# Altium schematic sheet Sheet_1_2022-04-25.schdoc
size 309 x 219 mm
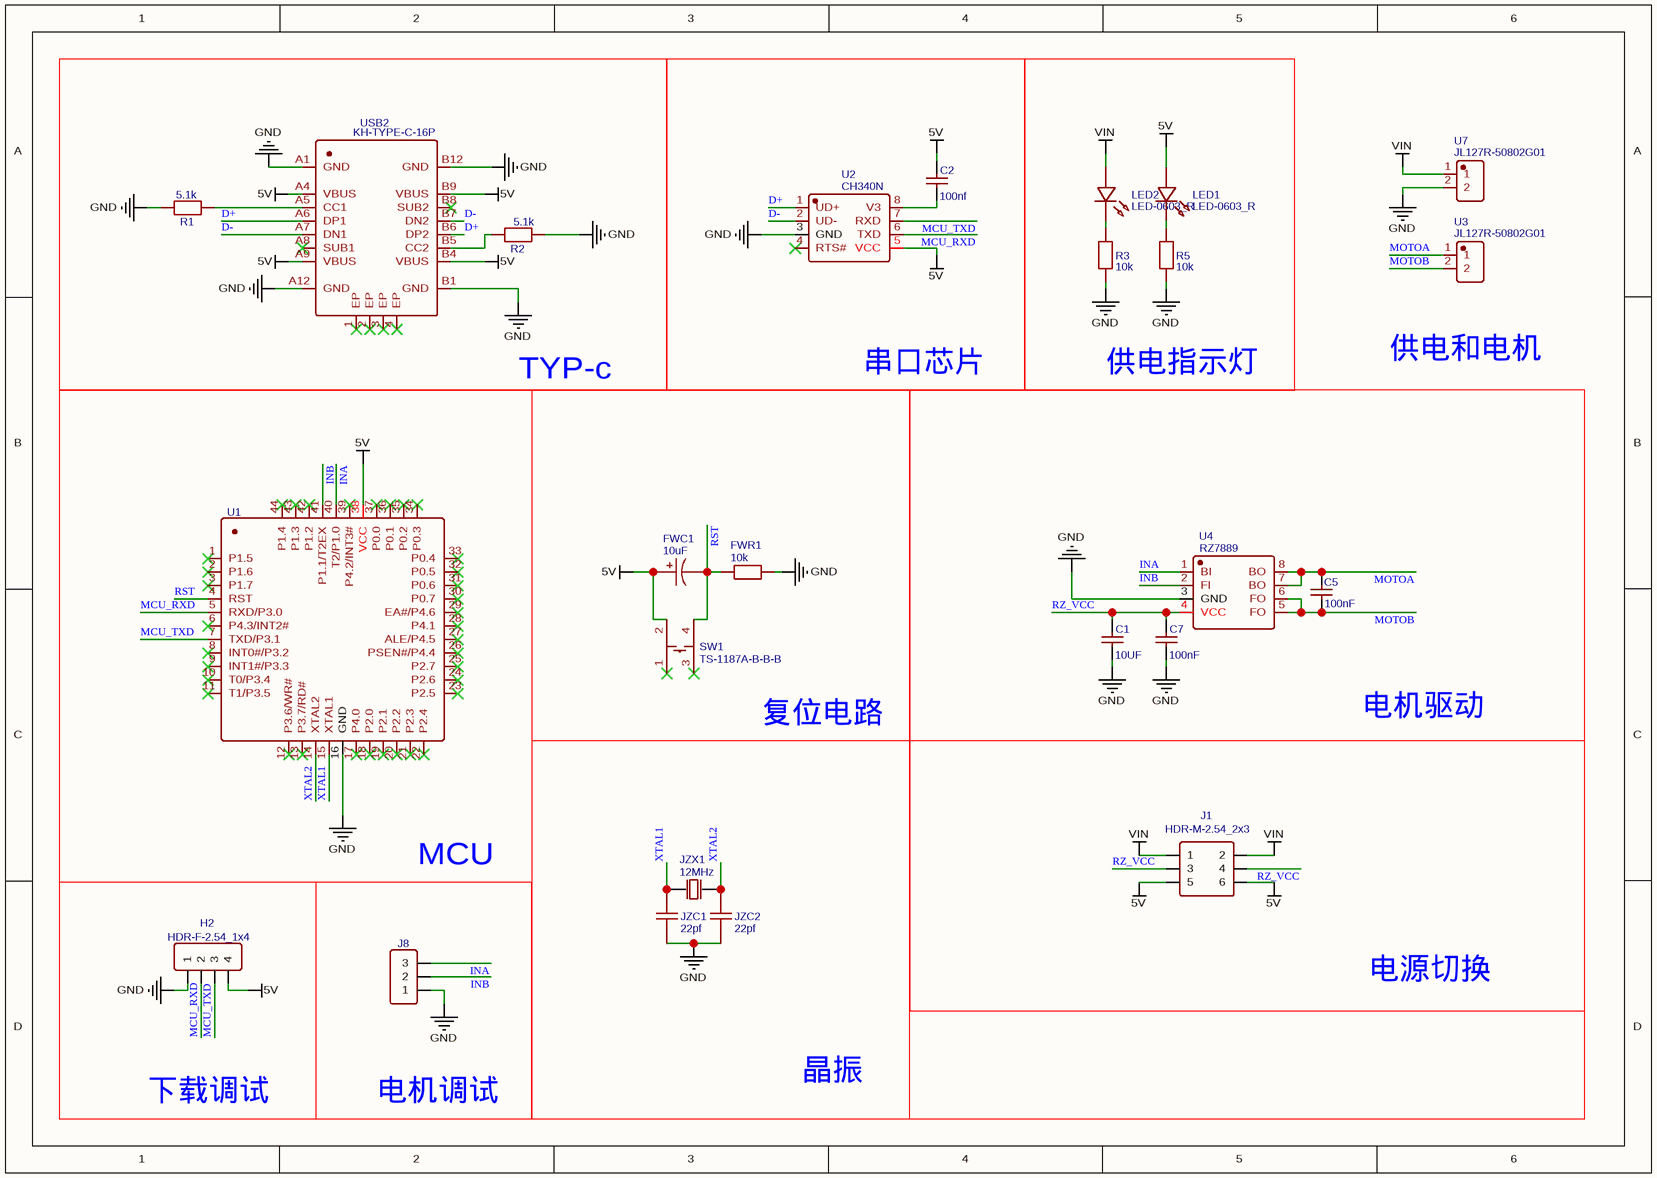
[diagram p0: Sheet_1_2022-04-25.schdoc]

## Parts
C1  10UF  [C0603]
C2  100nf  [C0603]
C5  100nF  [C0603]
C7  100nF  [C0603]
FWC1  10uF  [CASE-A_3216]
FWR1  10k  [R0603]
H2  HDR-F-2.54_1x4  [HDR-F-2.54_1X4]
J1  HDR-M-2.54_2x3  [HDR-M-2.54_2X3]
J8  HDR-M-2.54_1x3  [HDR-M-2.54_1X3]  (value not drawn)
JZC1  22pf  [C0603]
JZC2  22pf  [C0603]
JZX1  12MHz  [HC-49US_L11.5-W4.5-P4.88]
LED1  LED-0603_R  [LED0603_RED]
LED2  LED-0603_R  [LED0603_RED]
R1  5.1k  [R0603]
R2  5.1k  [R0603]
R3  10k  [R0603]
R5  10k  [R0603]
SW1  TS-1187A-B-B-B  [SW-SMD_4P-L5.1-W5.1-P3.70-LS6.5-TL-2]
U1  C8707-40I_C8707  [LQFP-44_L10.0-W10.0-P0.80-LS12.0-BL]  (value not drawn)
U2  CH340N  [SOP-8_L5.0-W4.0-P1.27-LS6.0-BL]
U3  JL127R-50802G01  [CONN-TH_3P-P5.08_JL127R-50802G01]
U4  RZ7889  [SOP-8_L4.9-W3.9-P1.27-LS6.0-BL]
U7  JL127R-50802G01  [CONN-TH_3P-P5.08_JL127R-50802G01]
USB2  KH-TYPE-C-16P  [USB-C-SMD_KH-TYPE-C-16P]

## Blocks framed on the sheet
TYP-c: R1 R2 USB2
串口芯片: C2 U2
供电指示灯: LED1 LED2 R3 R5

## Nets
5V: C2.2 FWC1.1 H2.4 J1.5 J1.6 LED1.1 SW1.2(B) U1.38(VCC) U2.5(VCC) USB2.A4(VBUS) USB2.A9(VBUS) USB2.B4(VBUS) USB2.B9(VBUS)
GND: C1.1 C7.1 FWR1.1 H2.1 J8.1 JZC1.1 JZC2.1 R1.1 R2.2 R3.1 R5.1 U1.16(GND) U2.3(GND) U4.3(GND) U7.2 USB2.A1(GND) USB2.A12(GND) USB2.B1(GND) USB2.B12(GND)
VIN: J1.1 J1.2 LED2.1 U7.1
D+: U2.1(UD+) USB2.A6(DP1) USB2.B6(DP2)
D-: U2.2(UD-) USB2.A7(DN1) USB2.B7(DN2)
INA: J8.3 U1.40(T2/P1.0) U4.1(BI)
INB: J8.2 U1.41(P1.1/T2EX) U4.2(FI)
MCU_RXD: H2.2 U1.5(RXD/P3.0) U2.6(TXD)
MCU_TXD: H2.3 U1.7(TXD/P3.1) U2.7(RXD)
MOTOA: C5.2 U3.1 U4.7(BO) U4.8(BO)
MOTOB: C5.1 U3.2 U4.5(FO) U4.6(FO)
RST: FWC1.2 FWR1.2 SW1.4(D) U1.4(RST)
RZ_VCC: C1.2 C7.2 J1.3 J1.4 U4.4(VCC)
XTAL1: JZC1.2 JZX1.1(OSC1) U1.15(XTAL1)
XTAL2: JZC2.2 JZX1.2(OSC2) U1.14(XTAL2)
NetC2_1: C2.1 U2.8(V3)
NetLED1_2: LED1.2 R5.2
NetLED2_2: LED2.2 R3.2
NetR1_2: R1.2 USB2.A5(CC1)
NetR2_1: R2.1 USB2.B5(CC2)

Not connected (* = marked no-connect by the designer): SW1 1(A)* 3(C)*; U1 1(P1.5)* 2(P1.6)* 3(P1.7)* 6(P4.3/INT2#)* 8(INT0#/P3.2)* 9(INT1#/P3.3)* 10(T0/P3.4)* 11(T1/P3.5)* 12(P3.6/WR#)* 13(P3.7/RD#)* 17(P4.0)* 18(P2.0)* 19(P2.1)* 20(P2.2)* 21(P2.3)* 22(P2.4)* 23(P2.5)* 24(P2.6)* 25(P2.7)* 26(PSEN#/P4.4)* 27(ALE/P4.5)* 28(P4.1)* 29(EA#/P4.6)* 30(P0.7)* 31(P0.6)* 32(P0.5)* 33(P0.4)* 34(P0.3)* 35(P0.2)* 36(P0.1)* 37(P0.0)* 39(P4.2/INT3#)* 42(P1.2)* 43(P1.3)* 44(P1.4)*; U2 4(RTS#)*; USB2 1(EP)* 2(EP)* 3(EP)* 4(EP)* A8(SUB1)* B8(SUB2)*

## Notes on the sheet
- 供电和电机
- 复位电路
- 电机驱动
- MCU
- 电源切换
- 下载调试
- 电机调试
- 晶振

## Library data of the parts
C1 = 10UF: BOM_Manufacturer: FH; BOM_Manufacturer Part: 0603B104K500NT; nameAlias: Capacitance; BOM_Supplier: LCSC; BOM_Supplier Part: C30926; spicePre: C; spiceSymbolName: 0603B104K500NT
C2 = 100nf: BOM_Manufacturer: FH; BOM_Manufacturer Part: 0603B104K500NT; nameAlias: Capacitance; BOM_Supplier: LCSC; BOM_Supplier Part: C30926; spicePre: C; spiceSymbolName: 0603B104K500NT
C5 C7 = 100nF: BOM_Manufacturer: FH; BOM_Manufacturer Part: 0603B104K500NT; nameAlias: Capacitance; BOM_Supplier: LCSC; BOM_Supplier Part: C30926; spicePre: C; spiceSymbolName: 0603B104K500NT
FWC1 = 10uF: nameAlias: Value(F); Contributor: LCEDA_Lib; spicePre: C; spiceSymbolName: C_Tan_SMD_A_US
FWR1 R3 R5 = 10k: nameAlias: Value(Ω); Contributor: LCEDA_Lib; spicePre: R; spiceSymbolName: R_0603_EU
H2 = HDR-F-2.54_1x4: Contributor: LCEDA_Lib; BOM_Supplier Part: C225501; BOM_Supplier: LCSC; spicePre: H; spiceSymbolName: HDR-F-2.54_1x4
J1 = HDR-M-2.54_2x3: Contributor: LCEDA_Lib; BOM_Supplier Part: C65114; BOM_Supplier: LCSC; spicePre: J; spiceSymbolName: HDR-M-2.54_2x3
J8 = HDR-M-2.54_1x3: Contributor: LCEDA_Lib; BOM_Supplier Part: C180248; BOM_Supplier: LCSC; spicePre: J; spiceSymbolName: HDR-M-2.54_1x3
JZC1 JZC2 = 22pf: nameAlias: Value(F); Contributor: LCEDA_Lib; spicePre: C; spiceSymbolName: C_0603_US
JZX1 = 12MHz: BOM_Manufacturer: YXC; BOM_Manufacturer Part: X49SD1431818MSD2SC; nameAlias: Frequency; BOM_Supplier: LCSC; BOM_Supplier Part: C2206; spicePre: X; spiceSymbolName: X49SD1431818MSD2SC
LED1 LED2 = LED-0603_R: BOM_Manufacturer: EVERLIGHT(台湾亿光); BOM_Manufacturer Part: 19-217/R6C-AL1M2VY/3T; Contributor: LCEDA_01; BOM_Supplier Part: C72044; BOM_Supplier: LCSC; spicePre: L; spiceSymbolName: LED-0603_R
R1 R2 = 5.1k: nameAlias: Value(Ω); Contributor: LCEDA_Lib; spicePre: R; spiceSymbolName: R_0603_EU
SW1 = TS-1187A-B-B-B: BOM_Manufacturer: XKB Enterprise; Contributor: LCSC; BOM_Supplier: LCSC; BOM_Supplier Part: C528026; BOM_Manufacturer Part: TS-1187A-B-B-B; BOM_JLCPCB Part Class: Extended Part; spicePre: S; spiceSymbolName: TS-1187A-B-B-B
U1 = C8707-40I_C8707: BOM_Manufacturer: STC; BOM_Manufacturer Part: STC89C52RC-40I; BOM_Supplier: LCSC; BOM_Supplier Part: C8707; BOM_JLCPCB Part Class: Extended Part; spicePre: U; spiceSymbolName: STC89C52RC-40I_C8707
U2 = CH340N: BOM_Manufacturer: WCH(Jiangsu Qin Heng); Contributor: LCSC; BOM_Supplier: LCSC; BOM_Supplier Part: C506813; BOM_Manufacturer Part: CH340N; BOM_JLCPCB Part Class: Extended Part; spicePre: U; spiceSymbolName: CH340N
U3 U7 = JL127R-50802G01: BOM_Manufacturer: JILN(锦凌); Contributor: LCSC; BOM_Supplier: LCSC; BOM_Supplier Part: C2913255; BOM_Manufacturer Part: JL127R-50802G01; BOM_JLCPCB Part Class: Extended Part; spicePre: U; spiceSymbolName: JL127R-50802G01
U4 = RZ7889: BOM_Manufacturer: RZ; SMT Type: Extend; BOM_Supplier: LCSC; BOM_Manufacturer Part: RZ7889; BOM_Supplier Part: C83668; BOM_LCSC Assembly: Yes; spicePre: U; spiceSymbolName: RZ7889
USB2 = KH-TYPE-C-16P: BOM_Manufacturer: Shenzhen Kinghelm Elec; Contributor: LCSC; BOM_Supplier: LCSC; BOM_Supplier Part: C709357; BOM_Manufacturer Part: KH-TYPE-C-16P; spicePre: U; spiceSymbolName: KH-TYPE-C-16P